# Altium schematic sheet Sheet_1_2026-10-02.schdoc
size 199 x 164 mm
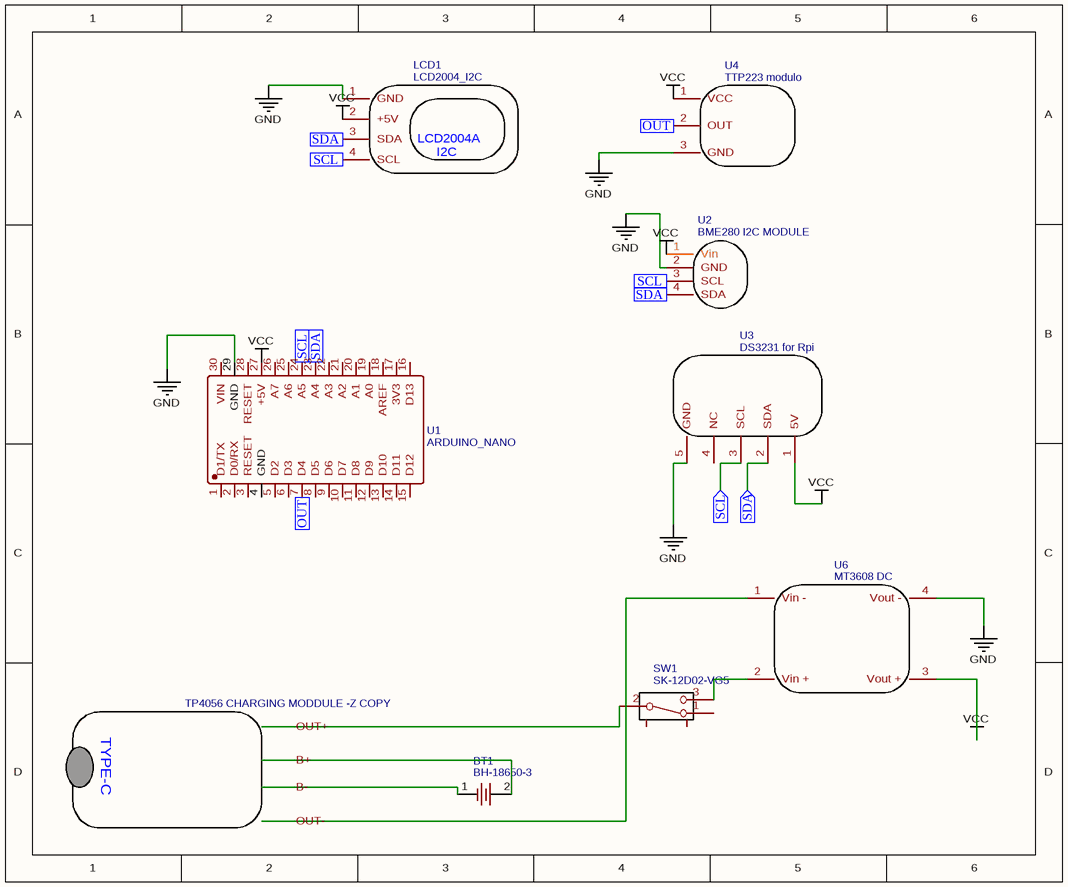
[diagram p0: Sheet_1_2026-10-02.schdoc]

## Parts
?  TP4056 CHARGING MODDULE -Z COPY  [TP4056-CHARGING-MODULE_TP4056]
BT1  BH-18650-3  [BAT-TH_BH-18650-3]
LCD1  LCD2004_I2C  [LCD2004+I2C_FP]
SW1  SK-12D02-VG5  [SW-TH_SK-12D02VG3]
U1  ARDUINO_NANO  [COMM-TH_ARDUINO_NANO]
U2  BME280 I2C MODULE  [BME280]
U3  DS3231 for Rpi  [DS3231]
U4  TTP223 modulo  [TTP223]
U6  MT3608 DC  [MT3608 DC]

## Ports
OUT (in), SCL (in), SDA (in)

## Nets
GND: LCD1.1(GND) U1.29(GND) U2.2(GND) U3.5(GND) U4.3(GND) U6.4(Vout_-)
VCC: LCD1.2(+5V) U1.27(+5V) U2.1(Vin) U3.1(5V) U4.1(VCC) U6.3(Vout_+)
OUT: U1.7(D4) U4.2(OUT) ; port OUT
SCL: LCD1.4(SCL) U1.24(A5) U2.3(SCL) U3.3(SCL) ; port SCL
SDA: LCD1.3(SDA) U1.23(A4) U2.4(SDA) U3.2(SDA) ; port SDA
Net?_1: ?.1(B+) BT1.2(+)
Net?_2: ?.2(B-) BT1.1(-)
Net?_3: ?.3(OUT+) SW1.2
Net?_4: ?.4(OUT-) U6.1(Vin_-)
NetSW1_3: SW1.3 U6.2(Vin_+)

Not connected (* = marked no-connect by the designer): SW1 1 4 5; U1 1(D1/TX) 2(D0/RX) 3(RESET) 4(GND) 5(D2) 6(D3) 8(D5) 9(D6) 10(D7) 11(D8) 12(D9) 13(D10) 14(D11) 15(D12) 16(D13) 17(3V3) 18(AREF) 19(A0) 20(A1) 21(A2) 22(A3) 25(A6) 26(A7) 28(RESET) 30(VIN); U3 4(NC)

## Notes on the sheet
- (in symbol LCD2004_I2C) LCD2004A / I2C
- (in symbol TP4056 CHARGING MODDULE -Z COPY) TYPE-C

## Library data of the parts
? = TP4056 CHARGING MODDULE -Z COPY: Contributor: zcam29112000; Manufacturer Part: TP4056; spicePre: A; spiceSymbolName: TP4056 CHARGING MODDULE
BT1 = BH-18650-3: Manufacturer: HanElectricity(瀚源); Contributor: lcsc; Supplier: LCSC; Supplier Part: C49118397; Manufacturer Part: BH-18650-3; JLCPCB Part Class: Extended Part; spicePre: B; spiceSymbolName: BH-18650-3
LCD1 = LCD2004_I2C: Manufacturer Part: LCD2004  I2C; Manufacturer: Various; Contributor: aleixomartins; link: https://www.robotshop.com/uk/iic-i2ctwi-serial-200420x4-lcd-module-shield-arduino-unomega2560.html?gclid=Cj0KCQjwpavpBRDQARIsAPfTwiyGF1f6oiEk6OW8X2CYoiw0-JQKbheO5Gnd5XsySLkRKBKcqSawlq8aAmdQEALw_wcB; spicePre: L; spiceSymbolName: LCD2004_I2C
SW1 = SK-12D02-VG5: Manufacturer: Rectangular Connectors - Contacts; Contributor: LCSC; Supplier: LCSC; Supplier Part: C136722; Manufacturer Part: SK-12D02-VG5; spicePre: S; spiceSymbolName: SK-12D02-VG5
U1 = ARDUINO_NANO: Manufacturer: null; Contributor: lcsc; Supplier: LCSC; Supplier Part: C9900017879; Manufacturer Part: ARDUINO_NANO; JLCPCB Part Class: Extended Part; spicePre: U; spiceSymbolName: ARDUINO_NANO
U2 = BME280 I2C MODULE: Contributor: Dorin Nicoara; spicePre: U; spiceSymbolName: BME280 I2C MODULE
U3 = DS3231 for Rpi: Contributor: George Vlachos; spicePre: U; spiceSymbolName: DS3231 for Rpi
U4 = TTP223 modulo: Contributor: JORGE CASTAÑEDA BENITEZ; spicePre: U; spiceSymbolName: TTP223 modulo
U6 = MT3608 DC: Contributor: vladpopof; spicePre: U; spiceSymbolName: MT3608 DC